# Altium schematic sheet USBasp.SchDoc
size A4
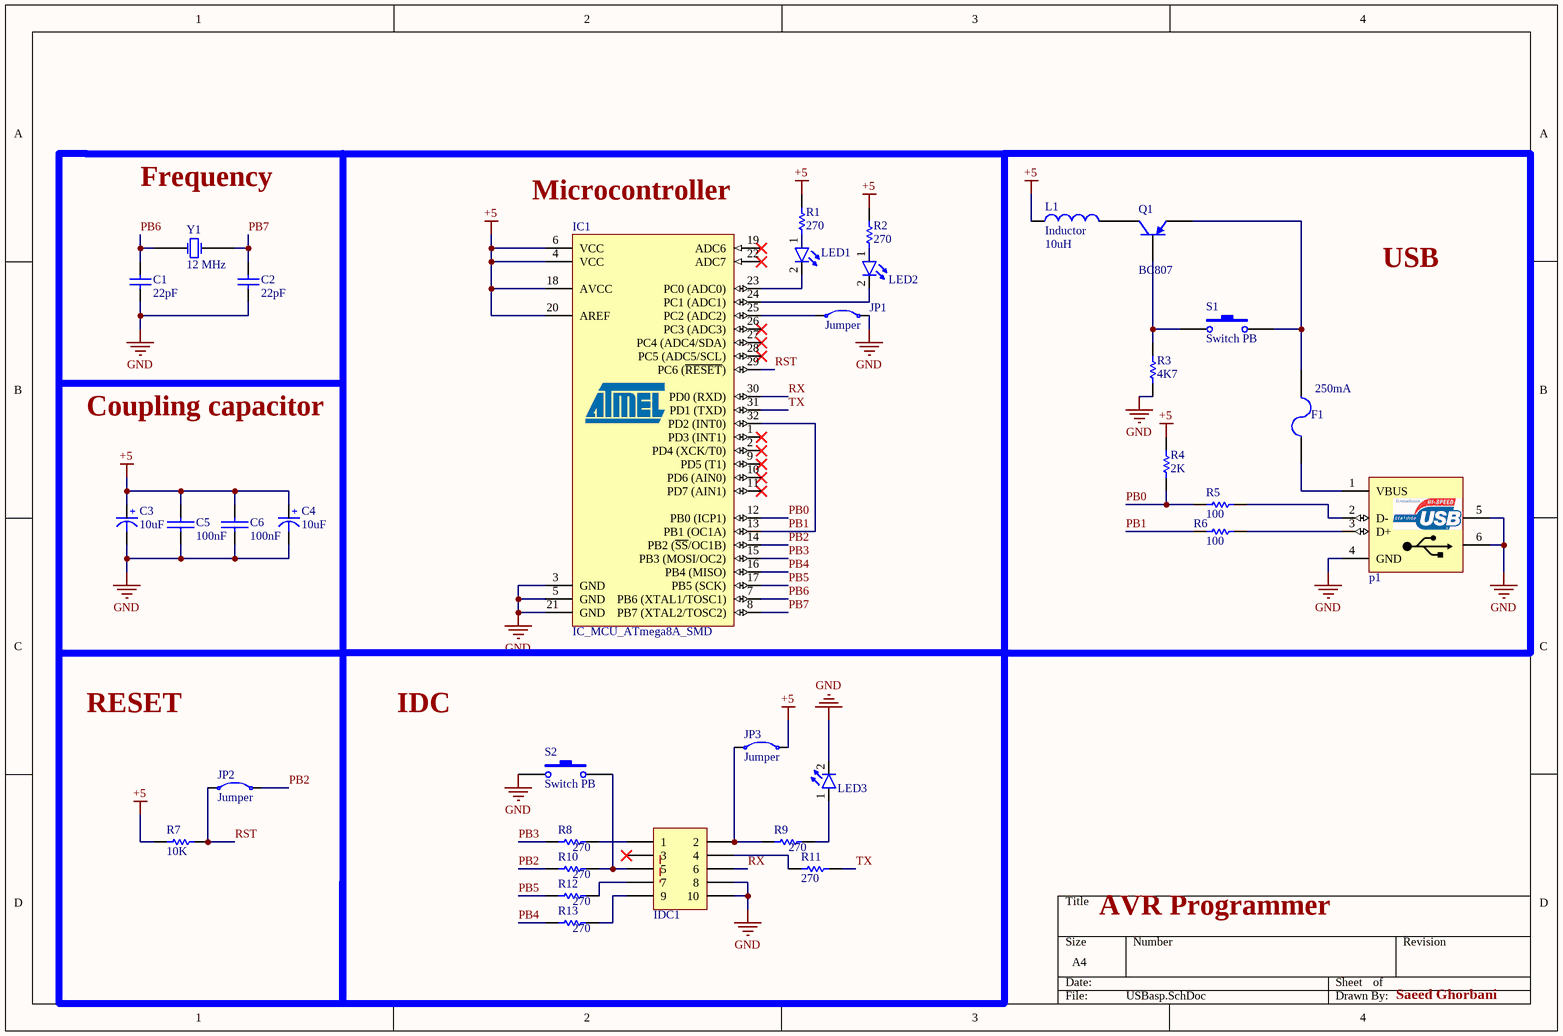
[diagram p0: USBasp.SchDoc]

## Parts
C1  22pF  [CAPC3413X12N]
C2  22pF  [CAPC3413X12N]
C3  10uF  [CAPP 1206 (3216X18L) Size A]
C4  10uF  [CAPP 1206 (3216X18L) Size A]
C5  100nF  [SMD_CAP_0805]
C6  100nF  [SMD_CAP_0805]
F1  250mA  [1206 FUSE]
IC1  IC_MCU_ATmega8A_SMD  [32A_N]
IDC1  CONNECTOR_IDC_5X2  [IDC2.54-10PIN - CROSS]  (value not drawn)
JP1  Jumper  [JP254_V]
JP2  Jumper  [JP254_V]
JP3  Jumper  [JP254_V]
L1  Inductor  value 10uH  [INDC1608L]
LED1  1206  [LED SMD 1206]  (value not drawn)
LED2  Red  [LED SMD 1206]  (value not drawn)
LED3  Red  [LED SMD 1206]  (value not drawn)
p1  USB Connector  [USB A TYPE Right Angle]  (value not drawn)
Q1  BC807  [SOT23_BEC_N]
R1  270  [RESC3413X04N]
R2  270  [RESC3413X04N]
R3  4K7  [RESC3413X04N]
R4  2K  [RESC3413X04N]
R5  100  [RESC3413X04N]
R6  100  [RESC3413X04N]
R7  10K  [RESC3413X04N]
R8  270  [RESC3413X04N]
R9  270  [RESC3413X04N]
R10  270  [RESC3413X04N]
R11  270  [RESC3413X04N]
R12  270  [RESC3413X04N]
R13  270  [RESC3413X04N]
S1  Switch PB  [SW-PB]
S2  Switch PB  [SW-PB]
Y1  12 MHz  [Crystal SMD]

## Nets
+5: C3.1(+) C4.1(+) C5.1(+) C6.1(+) IC1.4(VCC) IC1.6(VCC) IC1.18(AVCC) IC1.20(AREF) JP3.2 L1.1 R1.2 R2.2 R4.2 R7.1
GND: C1.1 C2.1 C3.2(-) C4.2(-) C5.2(-) C6.2(-) IC1.3(GND) IC1.5(GND) IC1.21(GND) IDC1.8 IDC1.10 JP1.2 LED3.2(K) p1.4(GND) p1.5(MH) p1.6(MH) R3.1 S2.1
PB0: IC1.12(PB0_(ICP1)) R4.1 R5.1
PB1: IC1.13(PB1_(OC1A)) IC1.32(PD2_(INT0)) R6.1
PB2: IC1.14(PB2_(~{SS}/OC1B)) JP2.2 R10.1
PB3: IC1.15(PB3_(MOSI/OC2)) R8.1
PB4: IC1.16(PB4_(MISO)) R13.1
PB5: IC1.17(PB5_(SCK)) R12.1
PB6: C1.2 IC1.7(PB6_(XTAL1/TOSC1)) Y1.1(OSC1)
PB7: C2.2 IC1.8(PB7_(XTAL2/TOSC2)) Y1.2(OSC2)
RST: IC1.29(PC6_(~{RESET})) JP2.1 R7.2
RX: IC1.30(PD0_(RXD)) IDC1.6
TX: IC1.31(PD1_(TXD)) R11.2
NetF1_1: F1.1 p1.1(VBUS)
NetF1_2: F1.2 Q1.2(E) S1.2
NetIC1_23: IC1.23(PC0_(ADC0)) LED1.2(K)
NetIC1_24: IC1.24(PC1_(ADC1)) LED2.2(K)
NetIC1_25: IC1.25(PC2_(ADC2)) JP1.1
NetIDC1_1: IDC1.1 R8.2
NetIDC1_2: IDC1.2 JP3.1 R9.1
NetIDC1_4: IDC1.4 R11.1
NetIDC1_5: IDC1.5 R10.2 S2.2
NetIDC1_7: IDC1.7 R12.2
NetIDC1_9: IDC1.9 R13.2
NetL1_2: L1.2 Q1.3(C)
NetLED1_1: LED1.1(A) R1.1
NetLED2_1: LED2.1(A) R2.1
NetLED3_1: LED3.1(A) R9.2
Netp1_2: p1.2(D-) R5.2
Netp1_3: p1.3(D+) R6.2
NetQ1_1: Q1.1(B) R3.2 S1.1

Not connected (* = marked no-connect by the designer): IC1 1(PD3_(INT1))* 2(PD4_(XCK/T0))* 9(PD5_(T1))* 10(PD6_(AIN0))* 11(PD7_(AIN1))* 19(ADC6)* 22(ADC7)* 26(PC3_(ADC3))* 27(PC4_(ADC4/SDA))* 28(PC5_(ADC5/SCL))*; IDC1 3*

## Notes on the sheet
- Frequency
- Microcontroller
- USB
- Coupling capacitor
- RESET
- IDC
- AVR Programmer
- Saeed Ghorbani
- (in symbol USB A CONNECTOR) D:AbbasBasereh

## Library data of the parts
C1 C2 = CAP SMD 0805: CAP 0805; Designer: Abbas Basereh; Desc.: CAP SMD 0805; Data: 16-12-2016
C3 C4 = Cap-Polar: Polar Capacitor; Designer: Saeid Jorablo; Organazation: ControTec; Voltage: 16V; Adding Date: 1387/12/20; Value: 10uF
C5 C6 = Cap-Bipolar: Bipolar Capacitor; Voltage: 100V; Designer: Saeid Jorablo; Organazation: ControTec; Adding Date: 1387/12/20; Value: 100nF
F1 = Fuse SMD1206: SMD Fuses 1206; Designer: Abbas Basereh; Desc.: SMD Fuses 1206; Data: 16-12-2016
IC1 = IC_MCU_ATmega8A_SMD: 8-bit AVR Microcontroller, 8KB Flash, 512 Bytes EEPROM, 1KB SRAM, 32-pin TQFP, Industrial Grade (-40°C to 85°C); Company: SJ Libraries; Designer: Eng. Saeid Jorablo; Voltage: (V); Published: 1-Apr-2010; DatasheetVersion: revC, Jul-2009; PackageReference: 32A; Publisher: Saeid UnLimited; PackageDescription: 32-Lead, 7x7x1.0 mm Body, 0.8mm Lead Pitch, Thin Profile Plastic Quad Flat Package (TQFP); Supplier 1: Digi-Key; Supplier Part Number 1: ATMEGA8A-AU-ND; Supplier 2: Farnell; Supplier Part Number 2: 1748532; Supplier 3: Mouser; Supplier Part Number 3: 556-ATMEGA8A-AU; Code_JEDEC: MS-026-ABA; ComponentLink1Description: Datasheet; ComponentLink1URL: http://www.alldatasheet.com/view.jsp?Searchword=; ComponentLink2Description: Reference; Mounting Technology: Surface Mount\Through-Hole; Category: IC_MCU; TYPE: IC; HelpURL: http://s3.picofile.com/file/7443264187/Coming_Soon_logo.gif
IDC1 = IDC_5X2 HEADER: Header, 5-Pin, Dual row; Manufacturer: CHINA; designer: ABBAS BASEREH; Connector type: IDC5X2  PROGPIN; Max Current: mA; LatestRevisionDate: 1395-11-17; Publisher: ABBAS BASEREH; Mounting Technology: Through-Hole; Category: Connector; Pin Count: 10; Status: Unreleased; ComponentLink1Description: Datasheet; ComponentLink2Description: Reference; Update: 2017-2-4
JP1-JP3 = JP: Jumper Component; Company: SJ Libraries; Designer: Eng. Saeid Jorablo; Category: Jumpers; ComponentLink1Description: Datasheet; ComponentLink2Description: Reference; HelpURL: http://s3.picofile.com/file/7443264187/Coming_Soon_logo.gif; Mounting Technology: Surface Mount\Through-Hole; Pin Count: 2; Publisher: SJ Unlimited; Status: Unreleased
L1 = Inductor: Code_IEC: 1005; Published: 8-Jun-2000; LatestRevisionDate: 29-May-2009; LatestRevisionNote: IPC-7351 Footprint Added.; PackageReference: 0402-A; Publisher: Altium Limited; PackageDescription: Chip Inductor; Code_JEITA: 0402
LED1 = LED: Designer: Saeid Jorablo; Organazation: ControTec; Color: Red; Adding Date: 1387/12/22; Size: SMD 1206
LED2 LED3 = LED: Designer: Saeid Jorablo; Organazation: ControTec; Adding Date: 1387/12/22; Color: Red; Size: SMD 1206
p1 = USB A CONNECTOR: USB Connector-A Type; Designer: ABBAS BASEREH; Max Current: 600mA; Mounting Technology: Surface Mount\Through-Hole; Category: Connector; Pin Count: 4-6; Publisher: ABBAS BASEREH; Status: Unreleased; ComponentLink1Description: Datasheet; ComponentLink2Description: Reference; Update: 1395-11-17
Q1 = PNP: PNP Bipolar Transistor; Published: 8-Jun-2000; LatestRevisionDate: 29-May-2009; LatestRevisionNote: IPC-7351 Footprint Added.; PackageVersion: Aug-1999; PackageReference: SOT-23B; Publisher: Altium Limited; PackageDescription: 3-Pin SOT-23 Package 0.95 mm Pitch, 2.4 mm Lead Span
R1-R13 = RES 0805 0.125W: RES 0805; Designer: Abbas Basereh; Desc.: RES SMD 0805; Data: 16-12-2016
S1 S2 = Switch PB: Push Button Switch
Y1 = XTAL_Crystal: XTAL Crystal; Designer: ABBAS BASEREH; Design Date: 2017-1-3; ComponentLink1Description: Datasheet; ComponentLink2Description: Reference; Mounting Technology: Surface Mount\Through-Hole; Value: 12 MHz; Status: Unreleased